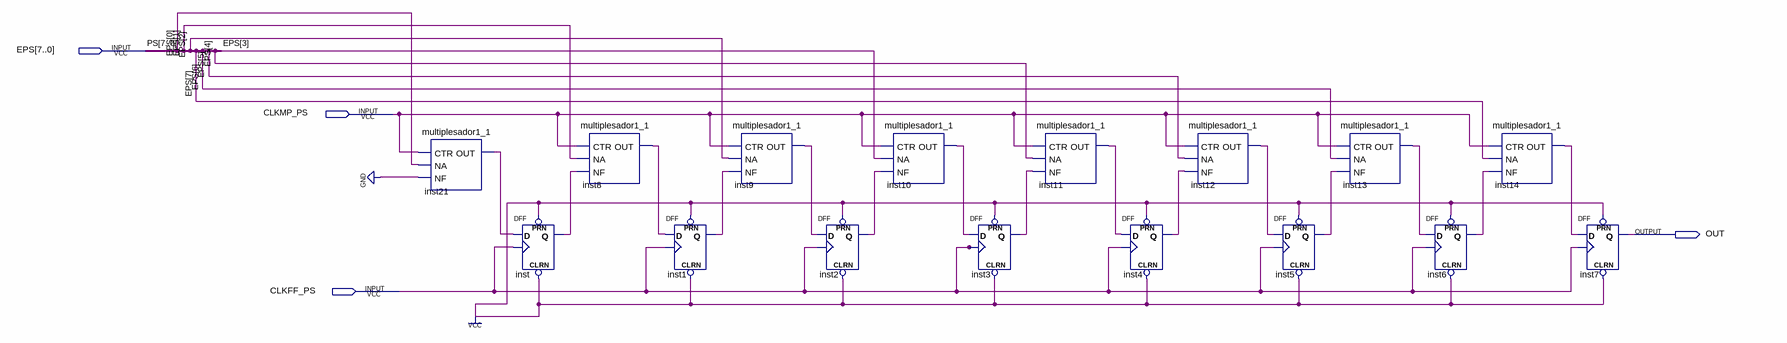
[diagram p0: schematic sheet]
// Quartus schematic PISO.bdf as structural Verilog: 16 symbols, 4 pins
module PISO (
  input  [7:0] EPS,
  input  CLKMP_PS,
  input  CLKFF_PS,
  output OUT
);

  wire inst1_q, inst2_q, inst3_q, inst4_q, inst5_q, inst6_q, inst8_out, inst9_out, inst10_out, inst11_out,
       inst12_out, inst13_out, inst14_out, inst21_out, inst_q;

  multiplesador1_1 inst21 (.CTR(CLKMP_PS), .NA(EPS[0]), .NF(1'b0), .OUT(inst21_out));
  DFF inst (.CLRN(1'b1), .CLK(CLKFF_PS), .D(inst21_out), .PRN(1'b1), .Q(inst_q));
  multiplesador1_1 inst8 (.CTR(CLKMP_PS), .NA(EPS[1]), .NF(inst_q), .OUT(inst8_out));
  DFF inst1 (.CLRN(1'b1), .CLK(CLKFF_PS), .D(inst8_out), .PRN(1'b1), .Q(inst1_q));
  multiplesador1_1 inst9 (.CTR(CLKMP_PS), .NA(EPS[2]), .NF(inst1_q), .OUT(inst9_out));
  DFF inst2 (.CLRN(1'b1), .CLK(CLKFF_PS), .D(inst9_out), .PRN(1'b1), .Q(inst2_q));
  multiplesador1_1 inst10 (.CTR(CLKMP_PS), .NA(EPS[3]), .NF(inst2_q), .OUT(inst10_out));
  DFF inst3 (.CLRN(1'b1), .CLK(CLKFF_PS), .D(inst10_out), .PRN(1'b1), .Q(inst3_q));
  multiplesador1_1 inst11 (.CTR(CLKMP_PS), .NA(EPS[4]), .NF(inst3_q), .OUT(inst11_out));
  DFF inst4 (.CLRN(1'b1), .CLK(CLKFF_PS), .D(inst11_out), .PRN(1'b1), .Q(inst4_q));
  multiplesador1_1 inst12 (.CTR(CLKMP_PS), .NA(EPS[5]), .NF(inst4_q), .OUT(inst12_out));
  DFF inst5 (.CLRN(1'b1), .CLK(CLKFF_PS), .D(inst12_out), .PRN(1'b1), .Q(inst5_q));
  multiplesador1_1 inst13 (.CTR(CLKMP_PS), .NA(EPS[6]), .NF(inst5_q), .OUT(inst13_out));
  DFF inst6 (.CLRN(1'b1), .CLK(CLKFF_PS), .D(inst13_out), .PRN(1'b1), .Q(inst6_q));
  multiplesador1_1 inst14 (.CTR(CLKMP_PS), .NA(EPS[7]), .NF(inst6_q), .OUT(inst14_out));
  DFF inst7 (.CLRN(1'b1), .CLK(CLKFF_PS), .D(inst14_out), .PRN(1'b1), .Q(OUT));

  // Other names for the same wires on the sheet: PS[7:0] = EPS
endmodule
